# Altium schematic sheet Accelerometer.SchDoc
size A4; SheetNumber: 2; SheetTotal: 2
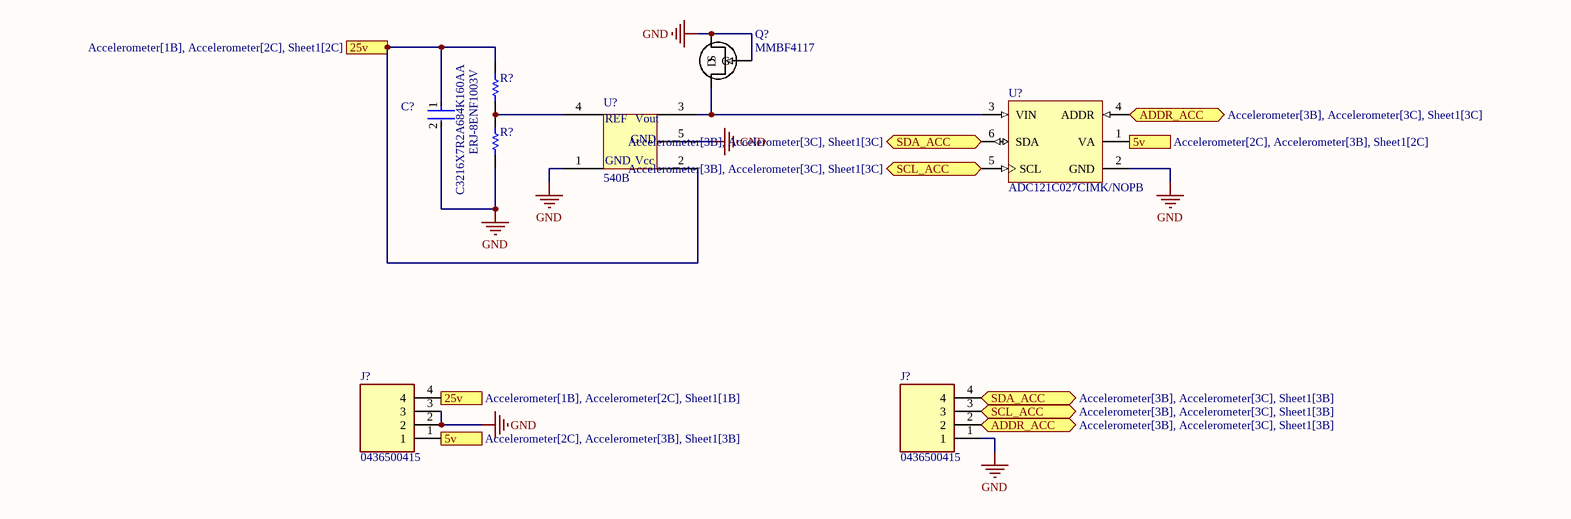
[diagram p0: Accelerometer.SchDoc]

## Parts
(Parts that share a designator on the sheet are numbered #1, #2 ... from top to bottom, then left to right.)
C?  C3216X7R2A684K160AA  [FP-C3216-160-0_2-IPC_B]
J?#1  0436500415  [MOLEX_0436500415]
J?#2  0436500415  [MOLEX_0436500415]
Q?  MMBF4117  [MMBF4117_OSI]
R?#1  (no value)  [RESC3216X70X50LL05T20]
R?#2  ERJ-8ENF1003V  [RESC3216X70X50LL05T20]
U?#1  ADC121C027CIMK/NOPB  [MK06A_L]
U?#2  540B  [SENTHER_540B]

## Ports
5v (in, see Accelerometer[2C], Accelerometer[3B], Sheet1[2C]), 5v (out, see Accelerometer[2C], Accelerometer[3B], Sheet1[3B]), 25v (in, see Accelerometer[1B], Accelerometer[2C], Sheet1[2C]), 25v (out, see Accelerometer[1B], Accelerometer[2C], Sheet1[1B]), ADDR_ACC (bidir, see Accelerometer[3B], Accelerometer[3C], Sheet1[3B]), ADDR_ACC (bidir, see Accelerometer[3B], Accelerometer[3C], Sheet1[3C]), SCL_ACC (bidir, see Accelerometer[3B], Accelerometer[3C], Sheet1[3B]), SCL_ACC (bidir, see Accelerometer[3B], Accelerometer[3C], Sheet1[3C]), SDA_ACC (bidir, see Accelerometer[3B], Accelerometer[3C], Sheet1[3B]), SDA_ACC (bidir, see Accelerometer[3B], Accelerometer[3C], Sheet1[3C])

## Nets
GND: C?.2 J?#1.2 J?#1.3 J?#2.1 Q?.2(S) Q?.3(G) R?#2.1 U?#1.2(GND)
5v: J?#1.1 U?#1.1(VA) ; port 5v
25v: C?.1 J?#1.4 R?#1.2 ; port 25v
ADDR_ACC: J?#2.2 U?#1.4(ADDR) ; port ADDR_ACC
SCL_ACC: J?#2.3 U?#1.5(SCL) ; port SCL_ACC
SDA_ACC: J?#2.4 U?#1.6(SDA) ; port SDA_ACC
NetQ?_1: Q?.1(D) U?#1.3(VIN)
NetR?#1_1: R?#1.1 R?#2.2

Not connected (* = marked no-connect by the designer): U?#2 1(GND) 2(Vcc) 3(Vout) 4(REF) 5(GND)

## Library data of the parts
C? = CMP-08246-005465-1: Multilayer Ceramic Capacitors 680nF ±10% 100V X7R SMD 1206; Series: C; Width: 0.063inch; Package Quantity: 2000; Tolerance: 10%; Case/Package: 1206; Min Operating Temperature: -55°C; Packaging: Tape and Reel; Voltage Rating: 100V; Case Code (Metric): 3216; Capacitance: 680nF; Length: 0.126inch; Thickness: 0.071inch; Case Code (Imperial): 1206; Max Operating Temperature: 125°C; RoHS Compliant: Yes; Mount: Surface Mount
J?#1 J?#2 = 0436500415: Connector Header Through Hole 4 position 0.118 (3.00mm); MF: Molex; MP: 0436500415; Price: None; SnapEDA_Link: https://www.snapeda.com/parts/0436500415/Molex/view-part/425083/?ref=snap; Availability: Unavailable; Value: *; Package: None
Q? = MMBF4117: No Description Available; Mfr_Name: onsemi; Type: DEV; Copyright: Copyright (C) 2024 Ultra Librarian. All rights reserved.; Manufacturer_Part_Number: MMBF4117; RefDes: RefDes
R?#1 = CMP-2003-00019-1: Manufacturer: Panasonic; Part Number: ERJ-8ENF1003V
R?#2 = CMP-2003-00019-1: Manufacturer: Panasonic; Part Number: ERJ-8ENF1003V
U?#1 = CMP-0054-00267-2: I2C-Compatible, 12-Bit Analog-to-Digital Converter with Alert Function, 6-pin Tiny SOT23, Pb-Free; Manufacturer: National Semiconductor; PackageTopMarking: X31C*XTT; PowerWise: Y; CompType: ADC IC; ComponentLink3Description: MK06A Package Page; Code_IPC: SOT26A-6; ComponentLink2URL: http://www.national.com/pf/AD/ADC121C027.html; DatasheetVersion: Apr-2009; RoHS: Y; PinCount: 6; RevisionNote: Component URLs added; ComponentLink1URL: http://www.national.com/ds/AD/ADC121C027.pdf; ComponentLink1Description: ADC121C027 Datasheet; PackageDescription: Molded TSOT, 2.97 x 1.65 x 0.87mm Body, 6 Lead, 0.95mm Pitch; PackageReference: MK06A; Code_JEDEC: MO-193-AA; ComponentLink3URL: http://www.national.com/packaging/folders/mk06a.html; PackageVersion: revE, Nov-2008; ComponentLink2Description: ADC121C027 Web Page
U?#2 = Component_1